# EAGLE design mcu_teensy4.1 (EAGLE 9.6.2)
c't-Bot v2 MCU Board; CC BY-SA 4.0, Timo Sandmann
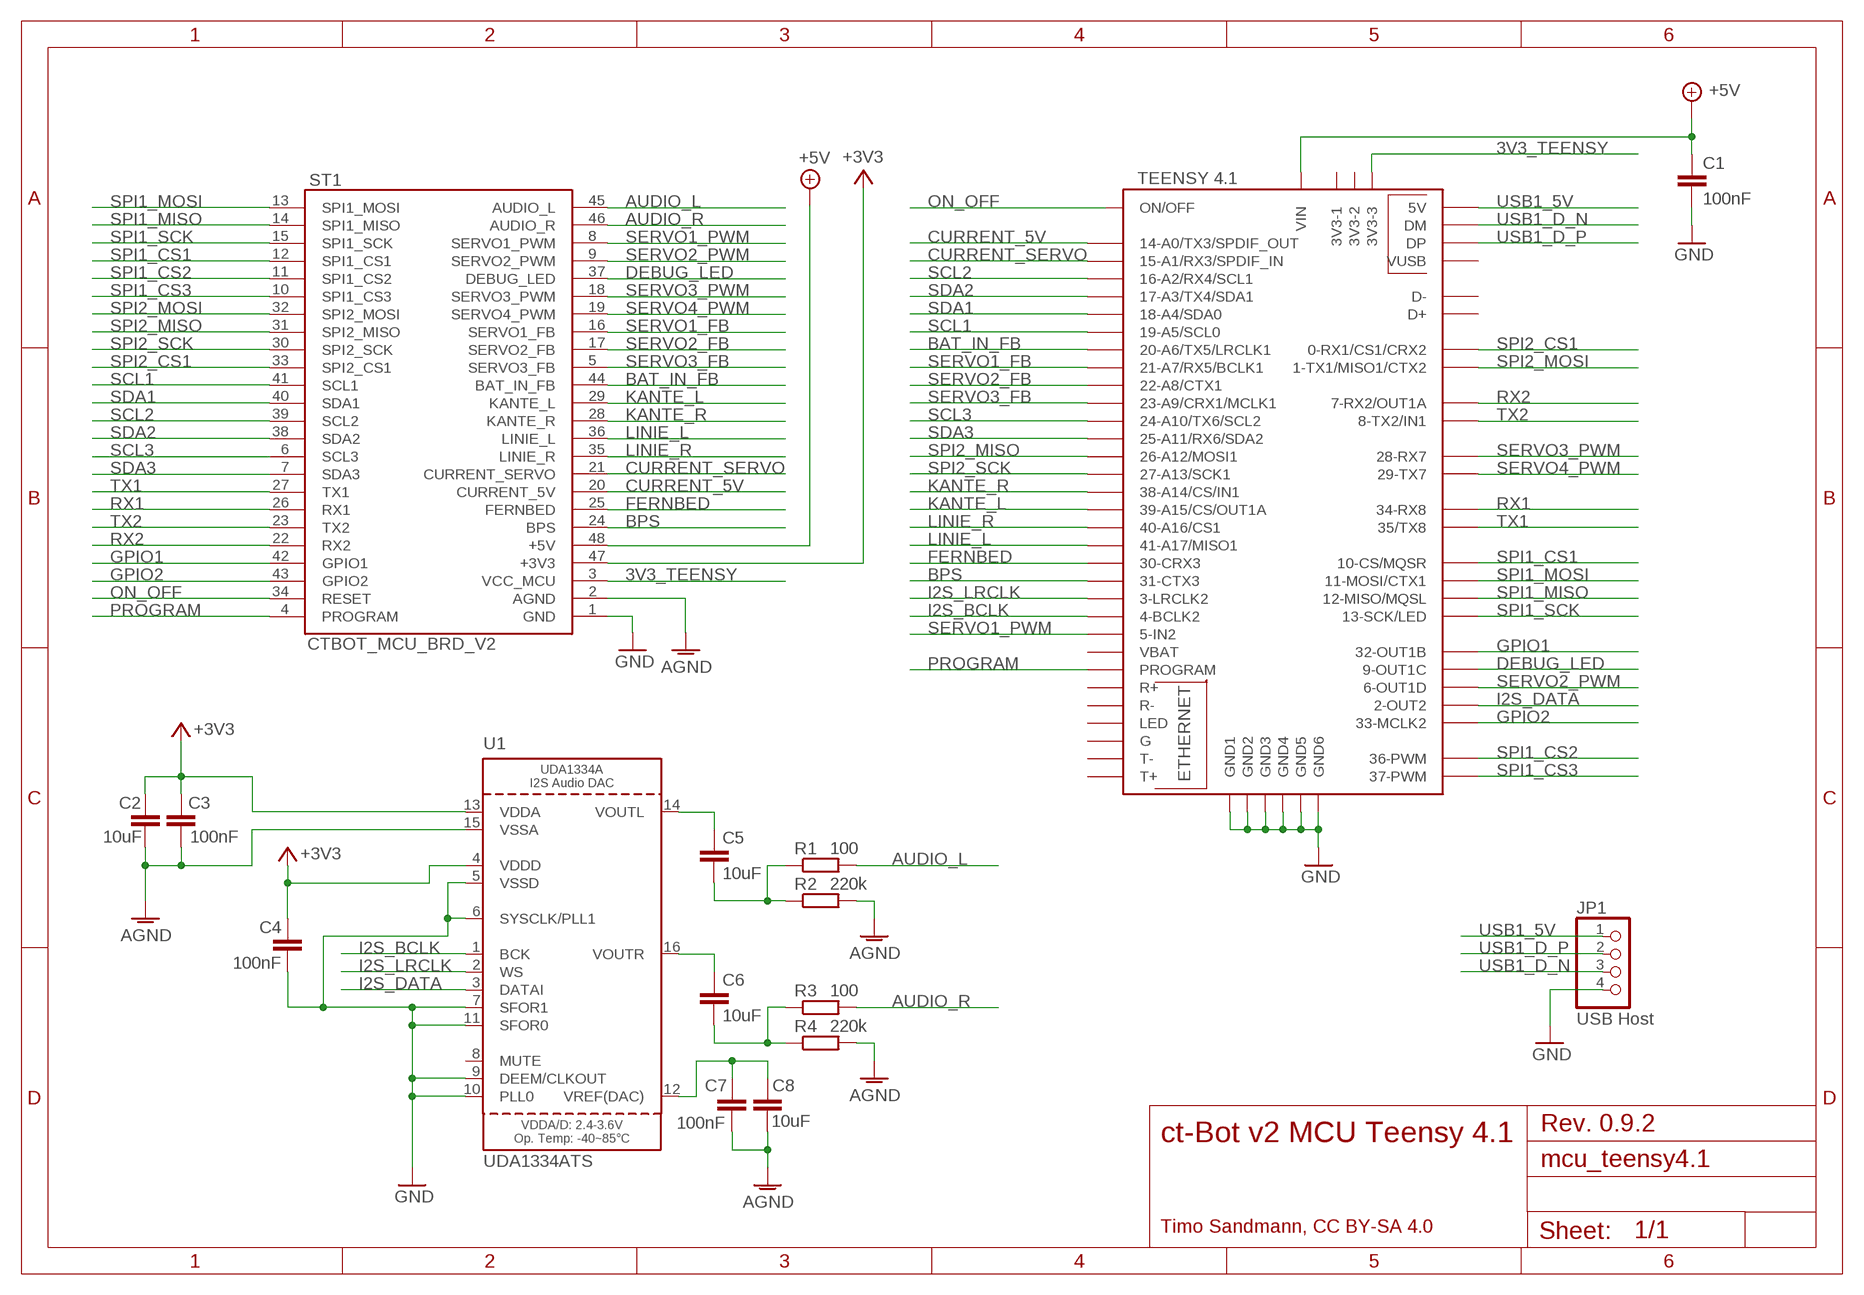
[diagram p0: schematic, sheet 1]

## Parts
C1  100nF  C-EUC0805  [C0805]
C2  10uF  C-EUC0805  [C0805]
C3  100nF  C-EUC0805  [C0805]
C4  100nF  C-EUC0805  [C0805]
C5  10uF  C-EUC0805  [C0805]
C6  10uF  C-EUC0805  [C0805]
C7  100nF  C-EUC0805  [C0805]
C8  10uF  C-EUC0805  [C0805]
JP1  USB Host  PINHD-1X4/90  [1X04/90]
R1  100  R-EU_R0805  [R0805]
R2  220k  R-EU_R0805  [R0805]
R3  100  R-EU_R0805  [R0805]
R4  220k  R-EU_R0805  [R0805]
ST1  CTBOT_MCU_BRD_V2  [DIP48]
U1  UDA1334ATS  AUDIO_I2S_UDA1334""  [SSOP16_4.4MM]
U$1  TEENSY41  [TEENSY41]

## Nets
3V3_TEENSY: ST1.3(VCC_MCU) U$1.3V3-3
+3V3: C2.1 C3.2 C4.2 ST1.47(+3V3) U1.4(VDDD) U1.13(VDDA)
+5V: C1.1 ST1.48(+5V) U$1.VIN
AGND: C2.2 C3.1 C7.1 C8.1 R2.2 R4.2 ST1.2(AGND) U1.15(VSSA)
AUDIO_L: R1.2 ST1.45(AUDIO_L)
AUDIO_R: R3.2 ST1.46(AUDIO_R)
BAT_IN_FB: ST1.44(BAT_IN_FB) U$1.20-A6/TX5/LRCLK1
BPS: ST1.24(BPS) U$1.31-CTX3
CURRENT_5V: ST1.20(CURRENT_5V) U$1.14-A0/TX3/SPDIF_OUT
CURRENT_SERVO: ST1.21(CURRENT_SERVO) U$1.15-A1/RX3/SPDIF_IN
DEBUG_LED: ST1.37(DEBUG_LED) U$1.9-OUT1C
FERNBED: ST1.25(FERNBED) U$1.30-CRX3
GND: C1.2 C4.1 JP1.4 ST1.1(GND) U1.5(VSSD) U1.6(SYSCLK/PLL1) U1.7(SFOR1) U1.9(DEEM/CLKOUT) U1.10(PLL0) U1.11(SFOR0) U$1.GND1 U$1.GND2 U$1.GND3 U$1.GND4 U$1.GND5 U$1.GND6
GPIO1: ST1.42(GPIO1) U$1.32-OUT1B
GPIO2: ST1.43(GPIO2) U$1.33-MCLK2
I2S_BCLK: U1.1(BCK) U$1.4-BCLK2
I2S_DATA: U1.3(DATAI) U$1.2-OUT2
I2S_LRCLK: U1.2(WS) U$1.3-LRCLK2
KANTE_L: ST1.29(KANTE_L) U$1.39-A15/CS/OUT1A
KANTE_R: ST1.28(KANTE_R) U$1.38-A14/CS/IN1
LINIE_L: ST1.36(LINIE_L) U$1.41-A17/MISO1
LINIE_R: ST1.35(LINIE_R) U$1.40-A16/CS1
N$1: C7.2 C8.2 U1.12(VREF(DAC))
N$2: C5.1 U1.14(VOUTL)
N$4: C6.1 U1.16(VOUTR)
N$5: C5.2 R1.1 R2.1
N$6: C6.2 R3.1 R4.1
ON_OFF: ST1.34(RESET) U$1.ON/OFF
PROGRAM: ST1.4(PROGRAM) U$1.PROGRAM
RX1: ST1.26(RX1) U$1.34-RX8
RX2: ST1.22(RX2) U$1.7-RX2/OUT1A
SCL1: ST1.41(SCL1) U$1.19-A5/SCL0
SCL2: ST1.39(SCL2) U$1.16-A2/RX4/SCL1
SCL3: ST1.6(SCL3) U$1.24-A10/TX6/SCL2
SDA1: ST1.40(SDA1) U$1.18-A4/SDA0
SDA2: ST1.38(SDA2) U$1.17-A3/TX4/SDA1
SDA3: ST1.7(SDA3) U$1.25-A11/RX6/SDA2
SERVO1_FB: ST1.16(SERVO1_FB) U$1.21-A7/RX5/BCLK1
SERVO1_PWM: ST1.8(SERVO1_PWM) U$1.5-IN2
SERVO2_FB: ST1.17(SERVO2_FB) U$1.22-A8/CTX1
SERVO2_PWM: ST1.9(SERVO2_PWM) U$1.6-OUT1D
SERVO3_FB: ST1.5(SERVO3_FB) U$1.23-A9/CRX1/MCLK1
SERVO3_PWM: ST1.18(SERVO3_PWM) U$1.28-RX7
SERVO4_PWM: ST1.19(SERVO4_PWM) U$1.29-TX7
SPI1_CS1: ST1.12(SPI1_CS1) U$1.10-CS\MQSR(10-CS/MQSR)
SPI1_CS2: ST1.11(SPI1_CS2) U$1.36-PWM
SPI1_CS3: ST1.10(SPI1_CS3) U$1.37-PWM
SPI1_MISO: ST1.14(SPI1_MISO) U$1.12-MISO/MQSL
SPI1_MOSI: ST1.13(SPI1_MOSI) U$1.11-MOSI/CTX1
SPI1_SCK: ST1.15(SPI1_SCK) U$1.13-SCK/LED
SPI2_CS1: ST1.33(SPI2_CS1) U$1.0-RX1/CS1/CRX2
SPI2_MISO: ST1.31(SPI2_MISO) U$1.26-A12/MOSI1
SPI2_MOSI: ST1.32(SPI2_MOSI) U$1.1-TX1/MISO1/CTX2
SPI2_SCK: ST1.30(SPI2_SCK) U$1.27-A13/SCK1
TX1: ST1.27(TX1) U$1.35-TX8(35/TX8)
TX2: ST1.23(TX2) U$1.8-TX2/IN1
USB1_5V: JP1.1 U$1.+5V(5V)
USB1_D_N: JP1.3 U$1.DM
USB1_D_P: JP1.2 U$1.DP
Unconnected: U1.8(MUTE) U$1.3V3-1 U$1.3V3-2 U$1.D+ U$1.D- U$1.G U$1.LED U$1.R+ U$1.R- U$1.T+ U$1.T- U$1.VBAT U$1.VUSB

## Notes on the sheet
- Rev. 0.9.2
- ct-Bot v2 MCU Teensy 4.1
- Timo Sandmann, CC BY-SA 4.0

## Library data of the parts
C1-C8 = rcl:C-EU: CAPACITOR, European symbol; SPICEPREFIX: C
JP1 = pinhead_ts:PINHD-1X4: PIN HEADER
R1-R4 = rcl:R-EU_: RESISTOR, European symbol; SPICEPREFIX: R
ST1 = ct-bot:CTBOT_MCU_BRD_V2
U1 = ct-bot:AUDIO_I2S_UDA1334: UDA1334 I2C Audio DAC Power Supply: 2.4-3.6V Sample frequencies from 16-100kHz
U$1 = teensy:TEENSY41

## Board
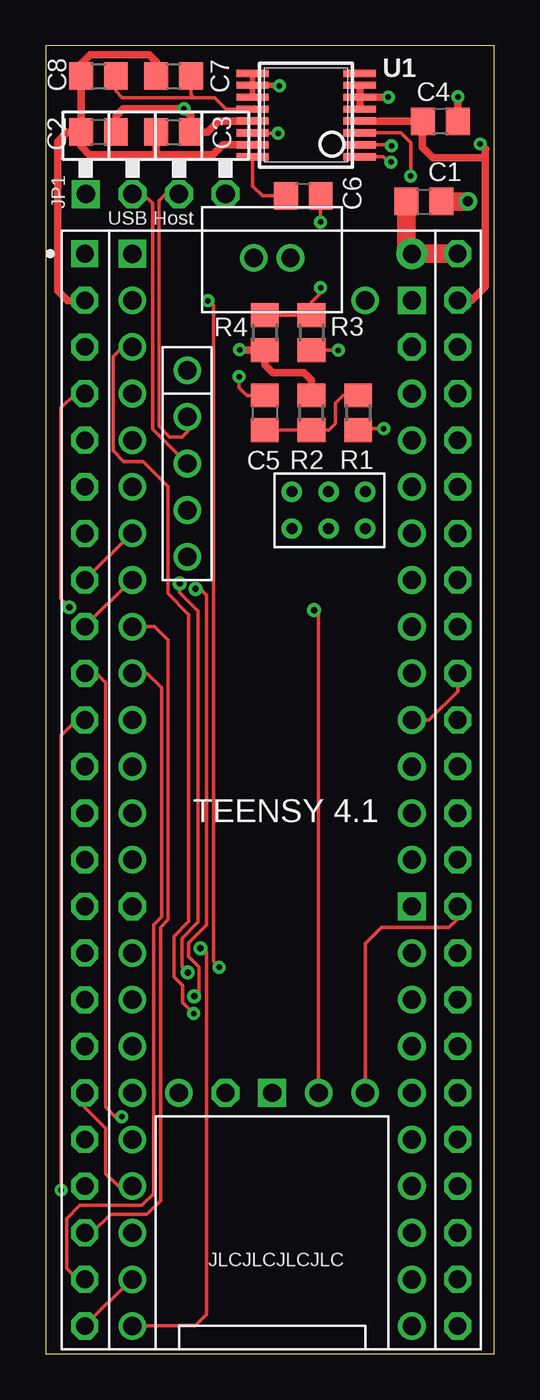
[diagram p1: board, top side]
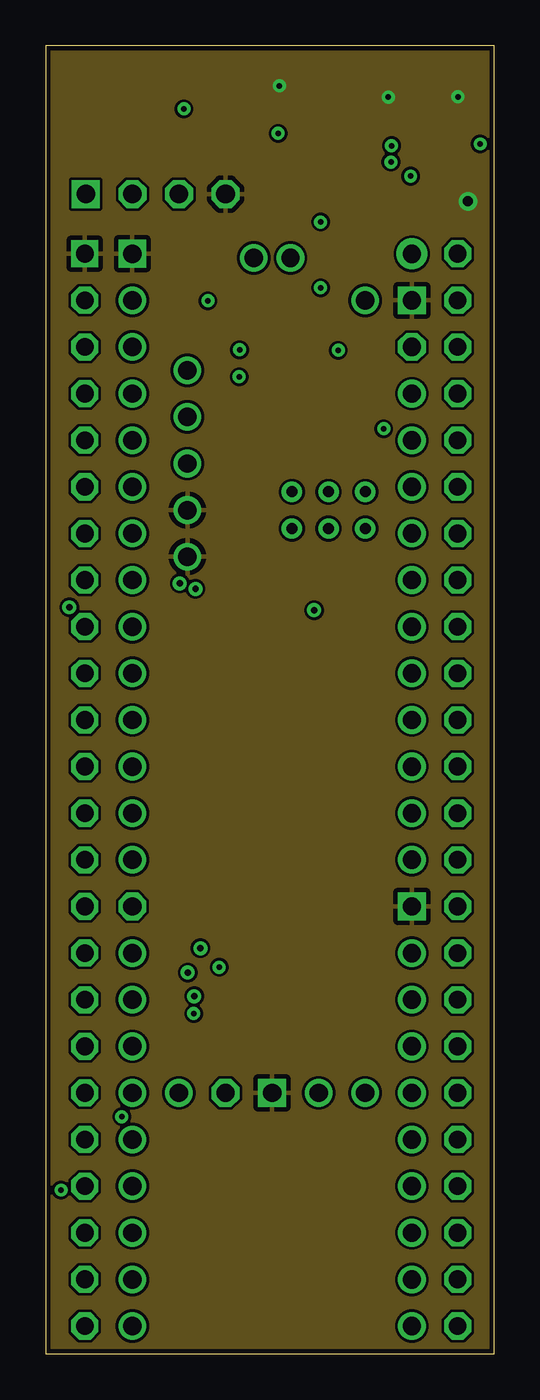
[diagram p2: board, inner layer GND]
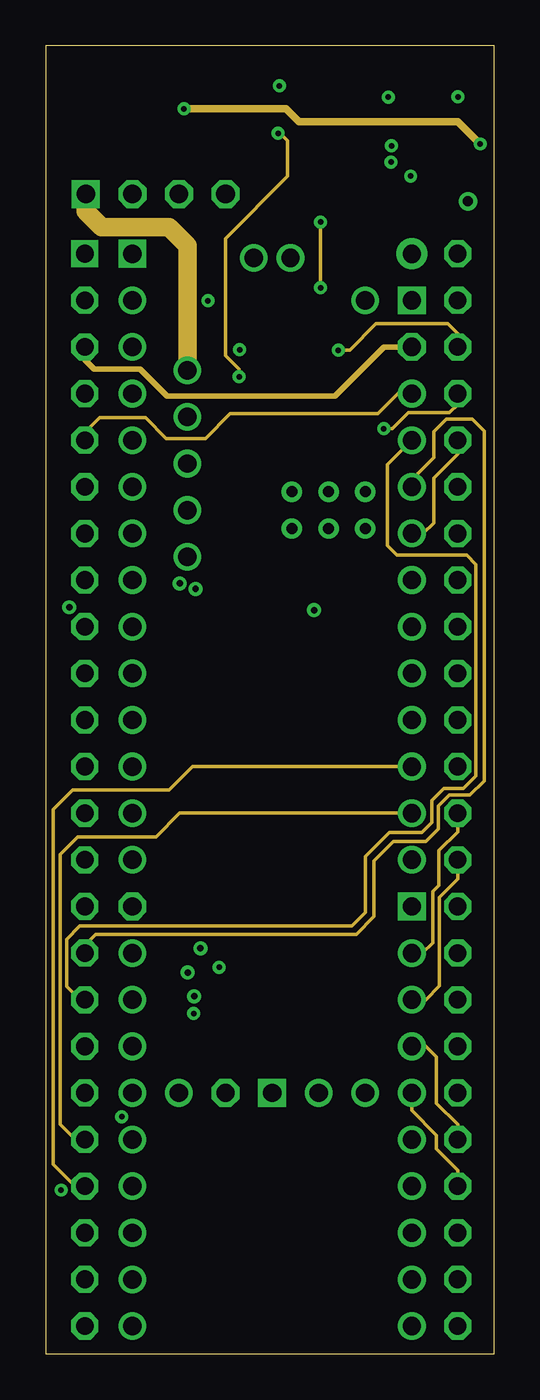
[diagram p3: board, inner layer ANALOG]
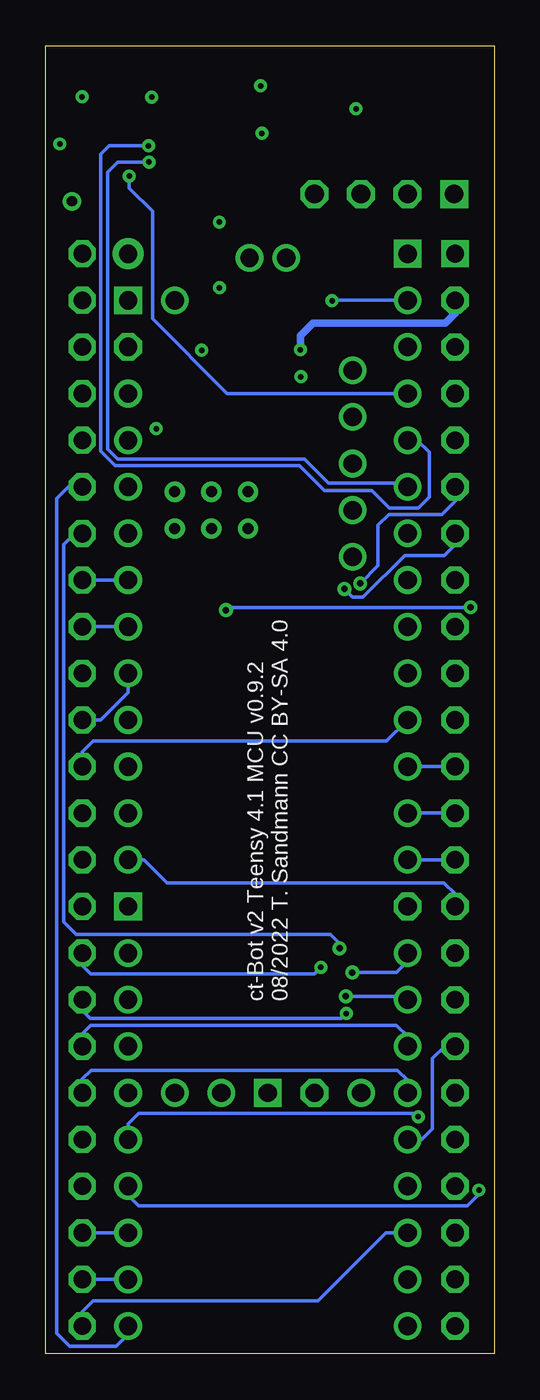
[diagram p4: board, bottom side, seen from below]

Size 24.43 x 71.25 mm. Coordinates in mm from the lower left corner, seen from the top.
Outline: 0,0 24.43,0 24.43,71.25 0,71.25 0,0
Copper layers (1+2*15+16): Top 0.035mm / dielectric 0.2mm / GND 0.0175mm / dielectric 1.065mm / ANALOG 0.0175mm / dielectric 0.2mm / Bottom 0.035mm
Design rules "jlcpcb_4layer_DRU": minimum track width 6mil, minimum drill 0.3mm, track to track 6mil, track to pad 6mil, pad to pad 6mil, via to via 6mil, smd to smd 6mil, copper to edge 10mil, drill to drill 6mil, minimum pad ring 10mil, minimum via ring 8mil, stop-mask expansion 4mil, vias tented up to drill 0mil, thermal gap 10mil

### Footprints (pad centres in the part's own frame; a part is rotated, then mirrored left to right if it is on the bottom)
C0805 = smd 1.3 x 1.5: 1 -0.95,0; 2 0.95,0
1X04/90 = drill 1.016 square: 1 -3.81,-3.81 | drill 1.016 octagon: 2 -1.27,-3.81; 3 1.27,-3.81; 4 3.81,-3.81
R0805 = smd 1.3 x 1.5: 1 -0.95,0; 2 0.95,0
DIP48 = drill 0.965 square: 1 1.27,59.69 | drill 0.965 octagon: 2 1.27,57.15; 3 1.27,54.61; 4 1.27,52.07; 5 1.27,49.53; 6 1.27,46.99; 7 1.27,44.45; 8 1.27,41.91; 9 1.27,39.37; 10 1.27,36.83; 11 1.27,34.29; 12 1.27,31.75; 13 1.27,29.21; 14 1.27,26.67; 15 1.27,24.13; 16 1.27,21.59; 17 1.27,19.05; 18 1.27,16.51; 19 1.27,13.97; 20 1.27,11.43; 21 1.27,8.89; 22 1.27,6.35; 23 1.27,3.81; 24 1.27,1.27; 25 21.59,1.27; 26 21.59,3.81; 27 21.59,6.35; 28 21.59,8.89; 29 21.59,11.43; 30 21.59,13.97; 31 21.59,16.51; 32 21.59,19.05; 33 21.59,21.59; 34 21.59,24.13; 35 21.59,26.67; 36 21.59,29.21; 37 21.59,31.75; 38 21.59,34.29; 39 21.59,36.83; 40 21.59,39.37; 41 21.59,41.91; 42 21.59,44.45; 43 21.59,46.99; 44 21.59,49.53; 45 21.59,52.07; 46 21.59,54.61; 47 21.59,57.15; 48 21.59,59.69
SSOP16_4.4MM = smd 0.4 x 1.75: 1 -2.275,-2.92; 2 -1.625,-2.92; 3 -0.975,-2.92; 4 -0.325,-2.92; 5 0.325,-2.92; 6 0.975,-2.92; 7 1.625,-2.92; 8 2.275,-2.92; 9 2.275,2.92; 10 1.625,2.92; 11 0.975,2.92; 12 0.325,2.92; 13 -0.325,2.92; 14 -0.975,2.92; 15 -1.625,2.92; 16 -2.275,2.92
TEENSY41 = drill 1: 0-RX1/CS1/CRX2 -27.94,-7.62; 1-TX1/MISO1/CTX2 -25.4,-7.62; 2-OUT2 -22.86,-7.62; 3-LRCLK2 -20.32,-7.62; 4-BCLK2 -17.78,-7.62; 5-IN2 -15.24,-7.62; 6-OUT1D -12.7,-7.62; 7-RX2/OUT1A -10.16,-7.62; 8-TX2/IN1 -7.62,-7.62; 9-OUT1C -5.08,-7.62; 10-CS\MQSR -2.54,-7.62; 11-MOSI/CTX1 0,-7.62; 12-MISO/MQSL 2.54,-7.62; 13-SCK/LED 2.54,7.62; 14-A0/TX3/SPDIF_OUT 0,7.62; 15-A1/RX3/SPDIF_IN -2.54,7.62; 16-A2/RX4/SCL1 -5.08,7.62; 17-A3/TX4/SDA1 -7.62,7.62; 18-A4/SDA0 -10.16,7.62; 19-A5/SCL0 -12.7,7.62; 20-A6/TX5/LRCLK1 -15.24,7.62; 21-A7/RX5/BCLK1 -17.78,7.62; 22-A8/CTX1 -20.32,7.62; 23-A9/CRX1/MCLK1 -22.86,7.62; 24-A10/TX6/SCL2 7.62,-7.62; 25-A11/RX6/SDA2 10.16,-7.62; 26-A12/MOSI1 12.7,-7.62; 27-A13/SCK1 15.24,-7.62; 28-RX7 17.78,-7.62; 29-TX7 20.32,-7.62; 30-CRX3 22.86,-7.62; 31-CTX3 25.4,-7.62; 32-OUT1B 27.94,-7.62; 33-MCLK2 27.94,7.62; 34-RX8 25.4,7.62; 35-TX8 22.86,7.62; 36-PWM 20.32,7.62; 37-PWM 17.78,7.62; 38-A14/CS/IN1 15.24,7.62; 39-A15/CS/OUT1A 12.7,7.62; 40-A16/CS1 10.16,7.62; 41-A17/MISO1 7.62,7.62; +5V -24.13,-4.62; D+ -30.25,-1; D- -30.25,1; DM -21.59,-4.62; DP -19.05,-4.62; GND4 -16.51,-4.62; GND5 -13.97,-4.62; ON/OFF 15.24,5.08; PROGRAM 15.24,2.54; VBAT 15.24,-5.08; VUSB -27.94,5.08 | drill 1 octagon: 3V3-1 5.08,-7.62; 3V3-2 15.24,-2.54; 3V3-3 -25.4,7.62 | drill 0.6: G -15.51,3.08; LED -17.51,3.08; R+ -17.51,5.08; R- -15.51,5.08; T+ -15.51,1.08; T- -17.51,1.08 | drill 1 square: GND1 -30.48,-7.62; GND2 15.24,0; GND3 5.08,7.62; GND6 -27.94,7.62 | drill 1 pad 1.676: VIN -30.48,7.62

### Placement (x,y rotation side)
C1  20.61,62.76 0 top
C2  2.87,66.55 180 top
C3  6.96,66.55 0 top
C4  21.51,67.12 180 top
C5  11.94,51.26 270 top
C6  14.03,63.07 0 top
C7  6.96,69.6 0 top
C8  2.87,69.6 0 top
JP1  5.99,66.99 0 top
R1  17.02,51.26 270 top
R2  14.48,51.26 90 top
R3  14.48,55.63 270 top
R4  11.94,55.63 270 top
ST1  0.86,0.23 0 top
U1  14.19,67.48 90 top
U$1  12.33,29.44 270 top

### Tracks (layer width: path | path; a pad name or v marks a point on that pad's centre or on a via)
3V3_TEENSY
  ANALOG 0.305: ST1.3 2.13,54.14 2.63,53.65 5.14,53.65 6.62,52.16 15.76,52.16 18.44,54.84 U$1.3V3-3
+3V3  (via drill 0.3)
  Top 0.305: 20.54,67.15 C4.2
  Top 0.406: ST1.47 23.21,57.38 23.97,58.14 23.97,65.09 | 23.97,65.09 23.9,65.16 21.1,65.16 20.54,65.72 20.54,67.15 U1.4 | U1.13 9.42,67.15 8.82,66.55 C3.2 7.91,67.43 v7.52,67.81 4.22,67.81 3.82,67.42 C2.1 | 23.97,65.09 23.97,65.61 v23.68,65.9
  ANALOG 0.406: v23.68,65.9 22.45,67.12 13.8,67.12 13.09,67.84 7.53,67.84 7.52,67.83 v7.52,67.81
+5V
  Top 1.016: ST1.48 U$1.VIN 19.66,60.21 C1.1
AGND  (via drill 0.3)
  Top 0.406: C2.2 C8.1 1.92,70.26 2.41,70.76 5.63,70.76 6.04,70.34 6.04,69.63 C7.1 | C2.2 1.92,65.77 2.37,65.32 6.01,65.32 | 6.01,65.32 9.12,65.32 9.65,65.85 U1.15 | C3.1 6.01,65.32 | C2.2 1.16,66.55 0.65,66.04 0.65,57.91 1.2,57.37 2.11,57.37 ST1.2 | v10.56,54.69 10.57,54.68 R4.2 11.94,53.85 12.35,53.44 14.08,53.44 14.48,53.04 R2.2
  Bottom 0.406: ST1.2 2.13,56.69 2.67,56.14 9.87,56.14 10.56,55.45 v10.56,54.69
AUDIO_L  (via drill 0.3)
  Top 0.203: R1.2 17.1,50.39 v18.42,50.39
  ANALOG 0.203: ST1.45 22.45,51.7 22,51.26 19.75,51.26 18.88,50.39 v18.42,50.39
AUDIO_R  (via drill 0.3)
  Top 0.203: R3.2 v15.93,54.68 v15.94,54.67
  ANALOG 0.203: v15.94,54.67 16.57,54.67 18,56.1 21.92,56.1 22.45,55.58 ST1.46
BAT_IN_FB
  ANALOG 0.203: U$1.20-A6/TX5/LRCLK1 20.56,44.68 21.14,45.26 21.14,47.69 22.45,49 ST1.44
BPS
  Top 0.203: ST1.24 4.67,4.04 U$1.31-CTX3
CURRENT_5V
  ANALOG 0.203: U$1.14-A0/TX3/SPDIF_OUT 7.28,29.44 6,28.16 1.74,28.16 0.78,27.2 0.78,12.49 1.61,11.66 ST1.20
CURRENT_SERVO
  ANALOG 0.203: U$1.15-A1/RX3/SPDIF_IN 8.01,31.98 6.72,30.7 1.46,30.7 0.4,29.64 0.4,10.31 1.59,9.12 ST1.21
DEBUG_LED
  Bottom 0.203: ST1.37 22.45,32.79 21.86,33.38 5.86,33.38 U$1.9-OUT1C
FERNBED
  Bottom 0.203: U$1.30-CRX3 5.9,6.58 9.61,2.88 21.86,2.88 22.45,2.29 ST1.25
GND  (via drill 0.3, 0.55 pad 1)
  Top 0.305: U1.9 U1.10 | U1.11 U1.10 | U1.10 12.7,69.1 v12.73,69.07
  Top 0.406: v22.46,68.47 | C4.1 v22.46,68.47 | U1.7 U1.6 | U1.5 U1.6 | U1.6 v18.66,68.45 v18.66,68.46
  Top 1.016: C1.2 23,62.76 v23.01,62.78
  pour GND (rank 6): -2.92,71.8 26.46,71.8 26.46,-1.27 -2.92,-1.27
GPIO1  (via drill 0.35)
  Top 0.203: U$1.32-OUT1B 8.13,1.5 8.76,2.13 8.76,21.86 8.54,22.08 v8.43,22.08
  Bottom 0.203: v8.43,22.08 8.43,22.34 8.91,22.83 22.78,22.83 23.47,23.52 23.47,44.08 22.87,44.68 ST1.42
GPIO2
  Bottom 0.203: U$1.33-MCLK2 19.95,1.06 20.6,0.41 23.15,0.41 23.86,1.12 23.86,46.58 23.21,47.22 ST1.43
I2S_BCLK  (via drill 0.3)
  Top 0.203: v18.81,64.92 18.69,64.92 18.4,65.2 U1.1
  Bottom 0.203: v18.81,64.92 20.51,64.92 21.06,64.37 21.06,49.28 20.53,48.74 10.35,48.74 9.04,47.44 4.92,47.44 U$1.4-BCLK2
I2S_DATA  (via drill 0.3)
  Top 0.203: v19.88,64.15 19.88,65.97 19.35,66.5 U1.3
  Bottom 0.203: v19.88,64.15 19.88,63.51 18.62,62.24 18.62,56.38 14.55,52.3 U$1.2-OUT2
I2S_LRCLK  (via drill 0.3)
  Top 0.203: v18.84,65.81 18.8,65.85 U1.2
  Bottom 0.203: v18.84,65.81 20.99,65.81 21.45,65.35 21.45,49.16 20.67,48.38 10.6,48.38 9.25,47.03 6.66,47.03 5.71,46.08 4.12,46.08 3.54,46.65 3.54,49.11 4.2,49.76 U$1.3-LRCLK2
KANTE_L
  ANALOG 0.203: U$1.39-A15/CS/OUT1A 20.72,16.74 21.3,16.16 21.3,13.65 22.45,12.5 ST1.29
KANTE_R
  ANALOG 0.203: U$1.38-A14/CS/IN1 19.95,13.25 21.3,11.9 21.3,11.15 22.45,10 ST1.28
LINIE_L
  ANALOG 0.203: U$1.41-A17/MISO1 20.53,21.82 21.09,22.39 21.09,25.17 21.42,25.49 21.42,27.4 22.45,28.43 ST1.36
LINIE_R
  ANALOG 0.203: U$1.40-A16/CS1 20.72,19.28 21.45,20.02 21.45,24.86 22.45,25.85 ST1.35
N$1
  Top 0.203: C8.2 3.82,68.76 4.15,68.43 8.07,68.43 | 8.07,68.43 9.2,68.43 9.8,67.83 9.8,67.82 9.82,67.8 U1.12 | C7.2 7.91,68.59 8.07,68.43
N$2  (via drill 0.3)
  Top 0.203: U1.14 12.62,66.5 12.64,66.49 v12.66,66.49 | v10.54,53.23 10.54,52.62 10.95,52.21 C5.1
  ANALOG 0.203: v12.66,66.49 12.77,66.49 13.18,66.08 13.18,64.14 9.79,60.76 9.79,54.38 10.54,53.63 v10.54,53.23
N$4
  Top 0.203: C6.1 11.8,63.07 11.27,63.6 U1.16
N$5
  Top 0.203: R1.1 16.2,52.21 15.78,51.79 15.78,50.66 15.43,50.31 R2.1 C5.2
N$6  (via drill 0.3)
  Top 0.203: R4.1 R3.1 14.48,57.29 14.97,57.78 v14.97,58.07 | v14.98,61.65 C6.2
  ANALOG 0.203: v14.97,58.07 v14.98,58.08 v14.98,61.65
ON_OFF
  Top 0.203: U$1.ON/OFF 17.41,22.34 18.29,23.21 21.97,23.21 22.45,23.69 ST1.34
PROGRAM  (via drill 0.35)
  Top 0.203: U$1.PROGRAM 14.87,40.26 v14.62,40.51 | v1.28,40.66 0.81,41.13 0.81,51.5 1.61,52.3 ST1.4
  Bottom 0.203: v14.62,40.51 14.47,40.66 v1.28,40.66
RX1
  Bottom 0.203: U$1.34-RX8 ST1.26
RX2
  Top 0.203: U$1.7-RX2/OUT1A 4.72,39.62 5.92,39.62 6.66,38.88 6.66,23.65 6.24,23.23 6.24,8.33 5.5,7.59 3.52,7.59 2.51,6.58 ST1.22
SCL1
  Bottom 0.203: U$1.19-A5/SCL0 ST1.41
SCL2
  Top 0.203: U$1.16-A2/RX4/SCL1 20.88,34.52 22.45,36.09 ST1.39
SCL3  (via drill 0.35)
  Top 0.203: v7.3,41.96 7.3,41.48 8.31,40.46 8.31,23.51 7.42,22.61 7.42,21.08 v7.73,20.76
  Bottom 0.203: ST1.6 2.13,46.45 2.85,45.72 5.75,45.72 6.34,45.13 6.34,42.93 v7.3,41.97 v7.3,41.96 | v7.73,20.76 5.33,20.76 4.71,21.39 U$1.24-A10/TX6/SCL2
SDA1
  Bottom 0.203: U$1.18-A4/SDA0 ST1.40
SDA2
  Bottom 0.203: U$1.17-A3/TX4/SDA1 19.95,36.01 21.44,34.52 ST1.38
SDA3  (via drill 0.35)
  Top 0.203: v8.16,41.66 8.44,41.66 8.77,41.33 8.77,23.35 7.79,22.37 7.79,21.63 8.36,21.06 8.36,19.74 v8.09,19.47
  Bottom 0.203: ST1.7 2.13,44.08 2.72,43.48 4.88,43.48 7.14,41.22 7.72,41.22 v8.16,41.66 | v8.09,19.47 4.9,19.47 U$1.25-A11/RX6/SDA2
SERVO1_FB
  ANALOG 0.203: ST1.16 2.13,22.25 2.73,22.85 16.92,22.85 17.89,23.83 17.89,26.85 18.95,27.91 20.71,27.91 21.4,28.59 21.4,29.84 21.99,30.43 23.12,30.43 23.89,31.2 23.89,50.25 23.24,50.9 21.82,50.9 21.16,50.24 21.16,48.82 19.95,47.61 U$1.21-A7/RX5/BCLK1
SERVO1_PWM
  Top 0.203: ST1.8 4.67,44.68 U$1.5-IN2
SERVO2_FB
  ANALOG 0.203: U$1.22-A8/CTX1 18.61,48.42 18.61,44.03 19.14,43.5 22.94,43.5 23.44,43 23.44,31.46 22.77,30.79 21.71,30.79 21.04,30.12 21.04,28.95 20.48,28.39 18.72,28.39 17.42,27.09 17.42,24.05 16.67,23.3 1.85,23.3 1.14,22.58 1.14,20.01 1.86,19.28 ST1.17
SERVO2_PWM
  Top 0.203: ST1.9 4.67,42.14 U$1.6-OUT1D
SERVO3_FB
  ANALOG 0.203: U$1.23-A9/CRX1/MCLK1 19.19,52.3 18.09,51.21 10.05,51.21 8.71,49.86 6.55,49.86 5.43,50.98 2.92,50.98 2.13,50.19 ST1.5
SERVO3_PWM
  Bottom 0.203: U$1.28-RX7 3.94,11.66 3.35,12.25 3.35,16.08 2.69,16.74 ST1.18
SERVO4_PWM
  Top 0.203: ST1.19 2.13,13.42 3.27,12.27 3.27,9.81 3.96,9.12 U$1.29-TX7
SPI1_CS1
  Bottom 0.203: ST1.12 U$1.10-CS\MQSR | U$1.10-CS\MQSR
SPI1_CS2  (via drill 0.3)
  Top 0.203: ST1.11 1.68,34.52 0.83,33.67 v0.83,8.91
  Bottom 0.203: U$1.36-PWM 19.95,8.61 19.38,8.04 1.47,8.04 0.83,8.68 v0.83,8.91
SPI1_CS3  (via drill 0.3)
  Top 0.203: v4.13,12.91 3.79,12.91 3.26,13.43 3.26,36.57 2.77,37.06 ST1.10
  Bottom 0.203: U$1.37-PWM 19.95,12.53 19.39,13.09 4.32,13.09 v4.13,12.91
SPI1_MISO
  Bottom 0.203: ST1.14 U$1.12-MISO/MQSL | U$1.12-MISO/MQSL
SPI1_MOSI
  Bottom 0.203: ST1.13 U$1.11-MOSI/CTX1 | U$1.11-MOSI/CTX1
SPI1_SCK
  Bottom 0.203: ST1.15 2.13,25.03 2.75,25.65 17.82,25.65 19.07,26.9 U$1.13-SCK/LED
SPI2_CS1  (via drill 0.3)
  Top 0.203: v8.83,57.36 8.91,57.36 9.15,57.13 9.15,21.35 v9.44,21.06 v9.44,21.05
  Bottom 0.203: U$1.0-RX1/CS1/CRX2 8.81,57.38 v8.83,57.36 | v9.44,21.05 9.6,20.9 9.6,20.89 9.8,20.69 21.99,20.69 22.45,21.15 ST1.33
SPI2_MISO
  Bottom 0.203: U$1.26-A12/MOSI1 4.71,17.27 5.32,17.88 21.98,17.88 22.45,17.42 ST1.31
SPI2_MOSI  (via drill 0.3)
  Top 0.203: U$1.1-TX1/MISO1/CTX2 4.2,54.84 3.66,54.31 3.66,49.2 4.25,48.6 5.31,48.6 6.67,47.24 6.67,41.4 7.79,40.28 7.79,23.54 6.99,22.74 6.99,20.53 7.45,20.07 7.45,19.14 v8.06,18.53
  Bottom 0.203: v8.06,18.53 8.31,18.27 22.01,18.27 22.45,18.71 ST1.32
SPI2_SCK
  Bottom 0.203: U$1.27-A13/SCK1 4.71,14.89 5.26,15.44 21.97,15.44 22.45,14.97 ST1.30
TX1
  Bottom 0.203: U$1.35-TX8 ST1.27
TX2
  Top 0.203: U$1.8-TX2/IN1 5.52,37.06 6.3,36.28 6.3,23.79 5.88,23.37 5.88,8.71 5.23,8.07 1.85,8.07 1.14,7.35 1.14,4.66 1.75,4.04 ST1.23
USB1_5V
  ANALOG 1.016: U$1.+5V 7.71,60.37 6.72,61.37 3.05,61.37 2.18,62.24 JP1.1
USB1_D_N
  Top 0.203: U$1.DM 7.71,50.23 7.42,49.94 6.75,49.94 6.17,50.52 6.17,62.8 6.54,63.18 JP1.3
USB1_D_P
  Top 0.203: U$1.DP 7.69,48.49 5.81,50.38 5.81,62.66 5.3,63.18 JP1.2

### Text on the board
tNames: USB Host | JLCJLCJLCJLC
bNames: ct-Bot v2 Teensy 4.1 MCU v0.9.2 / 08/2022 T. Sandmann CC BY-SA 4.0